# Altium schematic sheet OSCILLAR_HFB_V1p0_HFPS.SchDoc
size A4; SheetNumber: 4; SheetTotal: 11; Title_: Low Frequency Path Switch
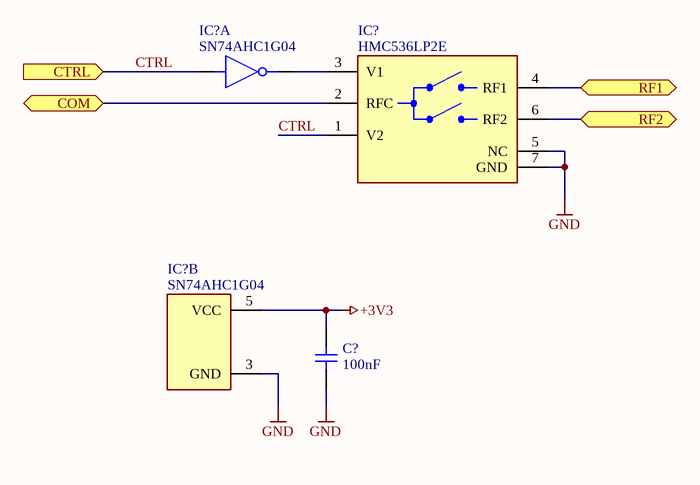
[diagram p0: OSCILLAR_HFB_V1p0_HFPS.SchDoc]

## Parts
(Parts that share a designator on the sheet are numbered #1, #2 ... from top to bottom, then left to right.)
C?  100nF  [CAP_0603]
IC?#1  SN74AHC1G04  [SC-70-5]  (part A of 2)
IC?#2  HMC536LP2E  [DFN-6]
IC?#3  SN74AHC1G04  [SC-70-5]  (part B of 2)

## Ports
COM (bidir, see OSCILLAR_HFB_V1p0_MAIN), CTRL (in, see OSCILLAR_HFB_V1p0_MAIN), RF1 (bidir, see OSCILLAR_HFB_V1p0_MAIN), RF2 (bidir, see OSCILLAR_HFB_V1p0_MAIN)

## Nets
+3V3: C?.2 IC?#3.5(VCC)
GND: C?.1 IC?#2.5(NC) IC?#2.7(GND) IC?#3.3(GND)
COM: IC?#2.2(RFC) ; port COM
CTRL: IC?#1.2(A) IC?#2.1(V2) ; port CTRL
RF1: IC?#2.4(RF1) ; port RF1
RF2: IC?#2.6(RF2) ; port RF2
NetIC?#1_4: IC?#1.4(Y) IC?#2.3(V1)

## Notes on the sheet
- Board:
- Author:
- Title:
- Project:
- SVN:
- Version:
- Sheet:
- of
- Contact:
- Modified:
- Size:
- A4

## Library data of the parts
C? = NP-CAPACITOR: MLCC capacitor; Type: CAP
IC?#1 IC?#3 = SN74AHC1G04: Signle inverter, 2V-5V; Part number: 595-SN74AHC1G04DCKT; Supplier: Mouser; Type: IC; ComponentLink1Description: Datasheet; ComponentLink2Description: Order; ComponentLink2URL: https://hu.mouser.com/ProductDetail/Texas-Instruments/SN74AHC1G04DCKT?qs=pdM4geFiyZTdyzHE1xB18A%3D%3D
IC?#2 = HMC536LP2E: RF Switch, SPDT, DC-6GHz; Part number: 584-HMC536LP2E; Supplier: Mouser; Type: IC; ComponentLink1Description: Datasheet; ComponentLink2Description: Order; ComponentLink2URL: https://hu.mouser.com/ProductDetail/Analog-Devices/HMC536LP2E?qs=3izLlwrMQ7kxqt%252Bzr3QT4g%3D%3D